# EAGLE schematic 328P_and_rs485 (EAGLE 7.5.0)
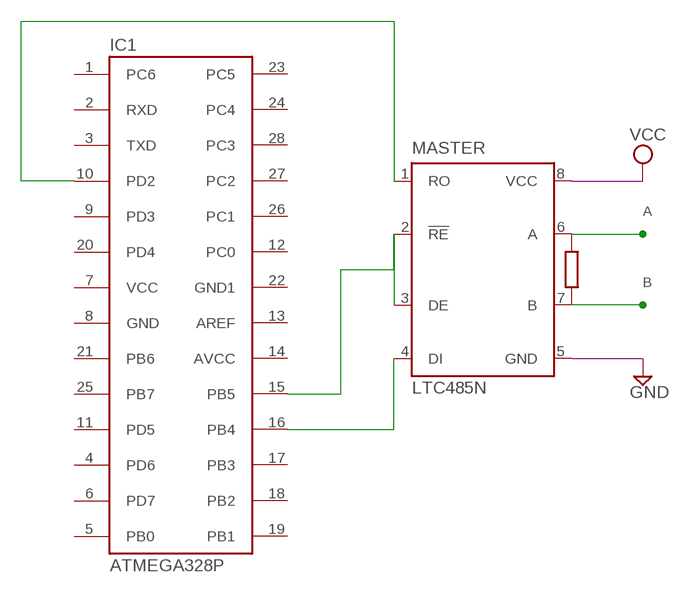
[diagram p0: schematic, sheet 1]

## Parts
IC1  ATMEGA328P  [DIL28-3]
MASTER  LTC485N  [DIL08]

## Nets
A: MASTER.6(A)
B: MASTER.7(B)
N$1: IC1.15(PB5) MASTER.2(!RE) MASTER.3(DE)
N$2: IC1.16(PB4) MASTER.4(DI)
N$3: IC1.10(PD2) MASTER.1(RO)
Unconnected: IC1.1(PC6) IC1.2(RXD) IC1.3(TXD) IC1.4(PD6) IC1.5(PB0) IC1.6(PD7) IC1.9(PD3) IC1.11(PD5) IC1.12(PC0) IC1.13(AREF) IC1.14(AVCC) IC1.17(PB3) IC1.18(PB2) IC1.19(PB1) IC1.20(PD4) IC1.21(PB6) IC1.23(PC5) IC1.24(PC4) IC1.25(PB7) IC1.26(PC1) IC1.27(PC2) IC1.28(PC3) MASTER.5(GND) MASTER.8(VCC)

## Power pins joined to a net without a drawn wire
GND: IC1.8(GND)
GND1: IC1.22(GND1)
VCC: IC1.7(VCC)

## Library data of the parts
IC1 = Arduino-AVR:ATMEGA328P
MASTER = linear-technology:LTC485: Low Power RS485 Interface Transceiver Source: http://www.linear.com/pc/downloadDocument.do?navId=H0,C1,C1007,C1017,P2064,D1718; OC_FARNELL: unknown; OC_NEWARK: unknown